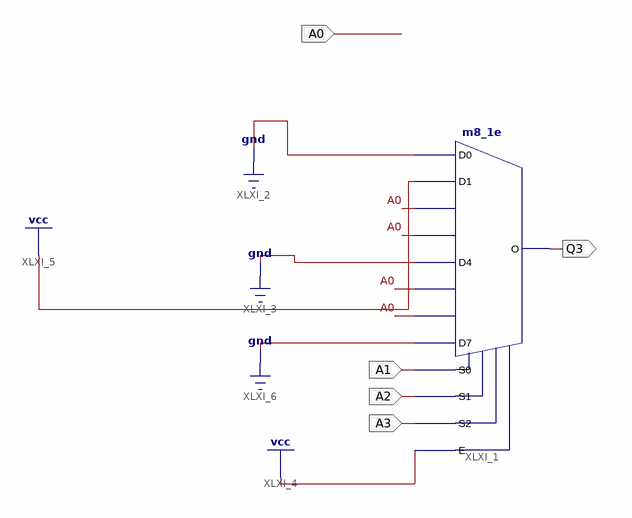
[diagram p0: schematic sheet 1]
// Xilinx ISE schematic Q3.sch (spartan3) as structural Verilog: 1 symbols, 5 ports
module Q3 (
  input  A0,
  input  A1,
  input  A2,
  input  A3,
  output Q3
);

  m8_1e XLXI_1 (
    .D0(1'b0), .D1(1'b1), .D2(A0), .D3(A0), .D4(1'b0), .D5(A0), .D6(A0), .D7(1'b0), .E(1'b1), .S0(A1),
    .S1(A2), .S2(A3), .O(Q3));
endmodule
